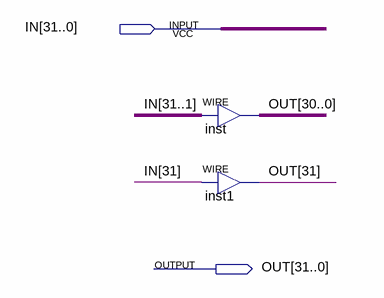
[diagram p0: schematic sheet]
// Quartus schematic sra1.bdf as structural Verilog: 2 symbols, 2 pins
module sra1 (
  input  [31:0] IN,
  output [31:0] OUT
);

  assign OUT[30:0] = IN[31:1];  // WIRE inst
  assign OUT[31] = IN[31];  // WIRE inst1
endmodule
